# EAGLE design DC-DC_prom_v2 (EAGLE 6.1)
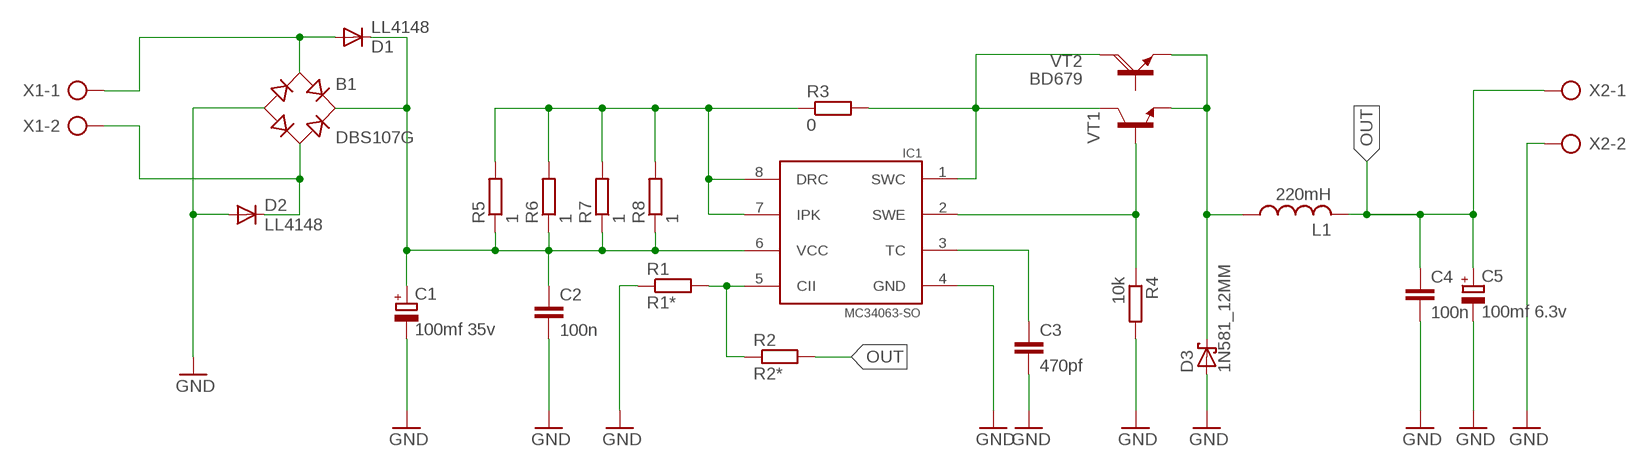
[diagram p0: schematic, sheet 1]

## Parts
B1  DBS107G  [DBS]
C1  100mf 35v  CPOL-EUE2.5-7  [E2,5-7]
C2  100n  C-EUC0805  [C0805]
C3  470pf  C-EUC0805  [C0805]
C4  100n  C-EUC0805  [C0805]
C5  100mf 6.3v  CPOL-EUE2.5-7  [E2,5-7]
D1  LL4148  [SOD80_DO213AA_MINIMELF]
D2  LL4148  [SOD80_DO213AA_MINIMELF]
D3  1N581_12MM  [DO41-12]
IC1  MC34063-SO  [SO8]
L1  220mH  L-US6000-XXX-RC  [6000-XXXX-RC]
R1  R1*  R-EU_M0805  [M0805]
R2  R2*  R-EU_M0805  [M0805]
R3  0  R-EU_M1406  [M1406]
R4  10k  R-EU_M0805  [M0805]
R5  1  R-EU_M1206  [M1206]
R6  1  R-EU_M1206  [M1206]
R7  1  R-EU_M1206  [M1206]
R8  1  R-EU_M1206  [M1206]
VT1  BCX56-16  [SOT89]
VT2  BD679  [TO126AV]
X1  AK500/2  [AK500/2]
X2  AK500/2  [AK500/2]

## Nets
GND: B1.- C1.- C2.2 C3.2 C4.2 C5.- D2.A D3.A IC1.4(GND) R1.1 R4.2 X2.2
N$1: D3.C L1.1 VT1.E VT2.E
N$2: IC1.5(CII) R1.2 R2.1
N$7: IC1.1(SWC) R3.2 VT1.C VT2.C
N$10: IC1.7(IPK) IC1.8(DRC) R3.1 R5.2 R6.2 R7.2 R8.2
N$15: B1.AC1 D1.A X1.1
N$16: B1.AC2 D2.C X1.2
N$29: B1.+ C1.+ C2.1 D1.C IC1.6(VCC) R5.1 R6.1 R7.1 R8.1
N$129: C3.1 IC1.3(TC)
N$151: IC1.2(SWE) R4.1 VT1.B
OUT: C4.1 C5.+ L1.2 R2.2 X2.1
Unconnected: VT2.B

## Library data of the parts
B1 = rectifier:DB?*G: Single Phase 1.0 AMP Glass Passivated Bridge Rectifier Taiwan Semiconductor Co.,Ltd. - TSC Source: http://www.taiwansemi.com/TSCbig5/ezcatfiles/cust/img/img/db101g.pdf http://www.ts.com.tw/db/pictures/modules/PDT/PDT060207001/DBLS201G.pdf
C1 C5 = rcl:CPOL-EU: POLARIZED CAPACITOR, European symbol
C2-C4 = rcl:C-EU: CAPACITOR, European symbol
D1 D2 = diodes_smd:LL4148: 1N4148 General Purpose Rectifie SMD-Version of 1N4148 Case: SOD 80 = DO 213 AA = MINIMELF (Glass) Author: Dipl.-Ing. FH Rainer Bayer HHN Hochschule Heilbronn, rainer.bayer@hs-heilbronn.de Ingenieurbüro ing-rb, mail@ing-rb.de
D3 = diode:1N581*: 1.0A SCHOTTKY BARRIER RECTIFIER Source: http://www.diodes.com/datasheets/ds23001.pdf
IC1 = mc34063:MC34063-SO: DC/DC converter MC34063 in SO08.
L1 = rcl:L-US: INDUCTOR, American symbol
R1-R8 = rcl:R-EU_: RESISTOR, European symbol
VT1 = mylib:BCX56-16
VT2 = transistor-power:BD679: NPN DARLINGTON TRANSISTOR
X1 X2 = con-ptr500:AK500/2: CONNECTOR; OC_FARNELL: unknown; OC_NEWARK: unknown

## Board
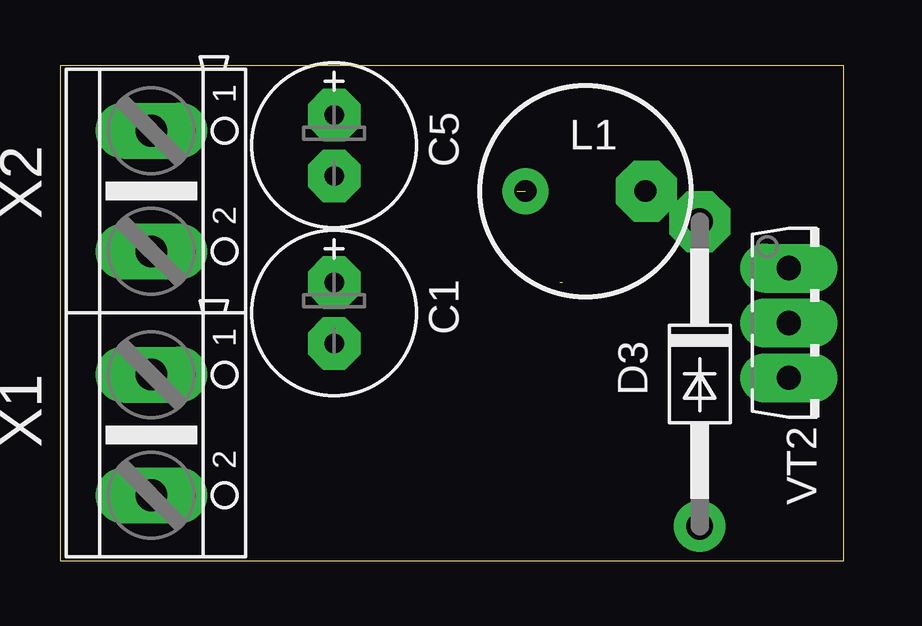
[diagram p1: board, top side]
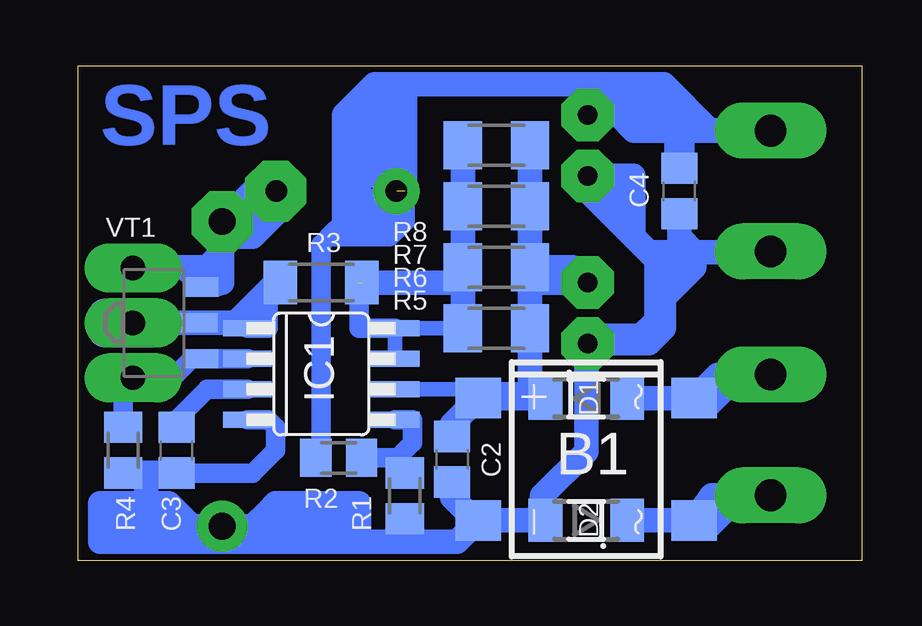
[diagram p2: board, bottom side, seen from below]

Size 32.68 x 20.63 mm. Coordinates in mm from the lower left corner, seen from the top.
Outline: 0,0 32.68,0 32.68,20.62 0,20.62 0,0
Copper layers (1*16): Top 0.035mm / dielectric 1.5mm / Bottom 0.035mm
Design rules: minimum track width 13mil, minimum drill 24mil, track to track 13mil, track to pad 8mil, pad to pad 8mil, via to via 8mil, smd to smd 8mil, copper to edge 40mil, drill to drill 8mil, minimum pad ring 20mil, minimum via ring 8mil, stop-mask expansion 4mil, vias tented up to drill 0mil, thermal gap 10mil

### Footprints (pad centres in the part's own frame; a part is rotated, then mirrored left to right if it is on the bottom)
DBS = smd 1.7 x 1.9: + -2.55,-4.5; - 2.55,-4.5; AC1 -2.55,4.5; AC2 2.55,4.5
E2,5-7 = drill 0.813 pad 1.6: + -1.27,0 | drill 0.813 pad 1.6 octagon: - 1.27,0
C0805 = smd 1.3 x 1.5: 1 -0.95,0; 2 0.95,0
SOD80_DO213AA_MINIMELF = smd 1.4 x 1.8: A 1.7,0; C -1.7,0
DO41-12 = drill 1.118: A 3.81,0; C -8.89,0
SO8 = smd 0.66 x 2.032: 1 -1.905,-3.073; 2 -0.635,-3.073; 3 0.635,-3.073; 4 1.905,-3.073; 5 1.905,3.073; 6 0.635,3.073; 7 -0.635,3.073; 8 -1.905,3.073
6000-XXXX-RC = drill 0.9 pad 1.422: 1 -2.5,0; 2 2.5,0
M0805 = smd 1.3 x 1.6: 1 -0.95,0; 2 0.95,0
M1406 = smd 1.4 x 1.8: 1 -1.7,0; 2 1.7,0
M1206 = smd 1.6 x 2: 1 -1.4,0; 2 1.4,0
SOT89 = smd 0.8 x 1.4: B -1.499,-1.981; E 1.499,-1.981 | smd 0.8 x 1.9: C 0,-1.727 | smd 2.032 x 3.65: C@1 0,0.94
TO126AV = drill 1.016 long: B 2.286,-1.27; C 0,-1.27; E -2.286,-1.27
AK500/2 = drill 1.321 long: 1 -2.515,0; 2 2.515,0

### Placement (x,y rotation side)
B1  11.49,4.22 270 bottom
C1  11.43,10.32 270 top
C2  17.08,4.22 270 bottom
C3  28.57,4.6 270 bottom
C4  7.62,15.4 270 bottom
C5  11.43,17.3 270 top
D1  11.49,6.76 0 bottom
D2  11.49,1.68 180 bottom
D3  26.67,5.24 270 top
IC1  22.54,7.78 270 bottom
L1  21.91,15.4 180 top
R1  19.05,2.7 90 bottom
R2  21.81,4.29 180 bottom
R3  22.54,11.59 180 bottom
R4  30.8,4.6 270 bottom
R5  15.24,9.68 180 bottom
R6  15.24,17.3 180 bottom
R7  15.24,14.76 180 bottom
R8  15.24,12.22 180 bottom
VT1  29.53,9.91 90 bottom
VT2  31.65,9.91 270 top
X1  3.81,5.24 270 top
X2  3.81,15.4 270 top

### Tracks (layer width: path | path; a pad name or v marks a point on that pad's centre or on a via)
GND
  Bottom 0.61: 30.79,3.97 R4.2
  Bottom 0.813: R1.1 19.05,0.79 | B1.- 15.99,1.55 15.88,1.43 | IC1.4 24.77,5.87 24.45,5.56 24.45,4.6 25.4,3.65 C3.2 | 20.32,0.79 23.5,0.79
  Bottom 1.016: C1.- 11.49,8.41 | 11.49,8.41 11.49,4.54 13.34,2.7 13.34,2.06 | 13.34,2.06 13.34,1.82 | 13.34,1.82 D2.A | 13.34,2.06 13.73,1.67 B1.- 16.87,0.79 19.05,0.79 20.32,0.79 20.96,0.79 | 13.34,1.82 13.34,1.43 | 9.53,13.49 11.43,15.4 C5.- 9.53,16.03 9.53,14.13 | 9.53,13.49 8.89,12.86 | 8.89,12.86 8.26,12.22 | 8.26,12.22 8.26,10.95 | 8.26,10.95 8.26,9.68 8.89,9.05 10.8,9.05 | C2.2 17.08,2.63 15.88,1.43 | C4.2 7.62,13.49 | 3.84,12.86 3.81,12.86 | D3.A 26.04,0.79 24.77,0.79 25.4,1.43 | D3.A 27.94,1.43 | C3.2 29.85,3.65 | 8.26,12.22 6.98,12.22 | 6.98,12.22 6.98,12.86 | 6.98,12.86 3.84,12.86 | 3.84,12.86 X2.2 | 7.62,13.49 7.62,12.86 8.57,12.86 | 8.89,12.86 8.57,12.86 | 8.57,12.86 6.98,12.86 | 6.98,12.86 7.62,13.49 | 6.98,12.22 8.26,10.95 | D3.A 27.31,0.79 | 29.85,2.38 28.89,2.38 27.94,1.43 | 27.94,1.43 30.48,2.06 31.75,1.43 29.21,1.43 | 20.96,0.79 20.96,2.38 24.45,2.38 24.77,2.06 | 20.96,0.79 23.5,0.79 31.75,0.79 31.75,2.38 29.85,2.38 | 25.4,1.43 24.77,2.06 | 24.77,2.06 21.59,2.06 21.59,1.43 24.77,1.43 | D3.A 25.4,1.43 | 29.85,3.65 R4.2 | 29.85,2.38 29.85,3.65 | 9.53,13.49 9.53,14.13 | 9.53,14.13 10.8,15.4 10.16,15.4 | C1.- 10.8,9.05 | 10.8,9.05 11.49,8.41 | C1.- 11.11,9.37 9.21,9.37 8.57,10 8.57,12.86
N$1
  Bottom 0.813: 26.67,12.86 26.67,11.59 26.85,11.4 VT1.E 28.33,12.19 VT2.E
  Bottom 1.016: L1.1 D3.C | D3.C 25.4,15.4 24.13,15.4 24.13,14.76 25.4,13.49 26.04,13.49 D3.C | D3.C 25.4,14.13 | 30.48,12.22 27.31,12.22 26.67,12.86 D3.C | D3.C 26.67,11.59
N$2
  Bottom 0.813: IC1.5 18.73,5.87 18.73,4.92 19.37,4.29 | R2.1 19.37,4.29 | 19.37,4.29 19.37,3.97 R1.2
N$5  (via drill 0.8 pad 2.54)
  other vias: 24.45,15.4
N$6  (via drill 1 pad 2.54)
  other vias: 26.67,14.13
N$7
  Bottom 0.813: VT1.C 25.96,9.91 IC1.1 24.77,9.68 24.77,10.95 R3.2 24.13,11.59
  Bottom 1.016: 24.13,11.59 24.77,10.95 25.81,9.91 VT1.C VT2.C | R3.2 24.45,11.59 26.04,10
N$8
  Bottom 1.016: 6.98,1.43 6.35,1.43 5.08,2.7
N$9
  Bottom 1.016: 6.98,6.51 6.35,6.51 5.08,7.78
N$10  (1 unrouted)
  Bottom 0.61: IC1.7 IC1.8 R5.2
  Bottom 0.813: IC1.8 20.96,9.68 20.96,11.59
  Bottom 1.016: R6.2 R7.2 R8.2 R5.2 | 20.96,11.59 16.51,11.59
N$11  (via drill 0.8 pad 2.18)
  other vias: 11.43,16.03
N$12  (via drill 0.8 pad 2.18)
  other vias: 11.43,11.59
N$14  (via drill 0.8 pad 2.18)
  other vias: 11.43,9.05
N$15
  Bottom 1.016: X1.1 6.01,7.75 B1.AC1 9.53,6.77 9.53,6.76 | D1.A 9.53,6.76 | 9.53,6.76 9.53,6.51
N$16
  Bottom 1.016: X1.2 6.26,2.72 B1.AC2 7.64,1.68 D2.C
N$17  (via drill 0.8 pad 2.18)
  other vias: 11.43,18.57
N$29
  Bottom 0.61: 13.84,7.02 B1.+ | B1.+ 15.61,6.77 | IC1.6 13.97,7.14 13.97,6.89 B1.+
  Bottom 1.016: R6.1 R7.1 R8.1 | R8.1 R5.1 13.84,7.02 | D1.C 14.09,6.76 B1.+ 17.08,5.68 C2.1 | R8.1 12.07,12.22 C1.+ 13.97,11.59
N$129
  Bottom 0.61: C3.1 28.57,5.87
  Bottom 0.813: IC1.3 27.31,7.14 28.57,5.87
N$151
  Bottom 0.813: R4.1 30.8,6.83 29.85,7.78 28.57,7.78 27.94,8.41 27.87,8.41 | 27.87,8.41 27.64,8.41 | 27.64,8.41 VT1.B 27.87,8.41 | IC1.2 27.64,8.41
OUT  (1 unrouted)
  Bottom 0.813: R2.2 22.54,3.97 22.54,13.18 22.23,13.49 | 22.23,13.49 20.32,13.49 | 20.32,13.49 19.68,13.49 19.05,14.13 19.05,15.4 20.32,14.13 21.59,14.13 | 20.32,13.49 19.68,14.13 19.05,16.03 | 21.59,14.13 22.23,13.49 | 21.59,14.13 19.05,16.03 | 19.05,16.03 20.32,14.76
  Bottom 1.016: X2.1 7.62,17.91 9.5,17.91 10.16,18.57 C5.+ 11.43,19.84 | 11.43,19.84 19.05,19.84 | 19.05,19.84 19.05,16.03 19.05,15.4 | 3.81,17.94 6.35,17.94 8.26,19.84 11.43,19.84 | 11.43,19.84 10.8,19.21 10.16,19.21 9.53,18.57 8.26,18.57 | 7.62,18.57 8.26,18.57 | 8.26,18.57 8.89,19.21 9.53,19.21 | 19.05,19.84 20.32,19.84 21.59,18.57 21.59,14.76 | 21.59,14.13 21.59,14.76 | 21.59,14.76 20.96,15.4 20.96,17.94 19.68,19.21 19.68,16.67 20.32,16.03 20.32,17.94
  Bottom 1.27: C4.1 7.62,17.91

### Text on the board
Bottom: SPS
Document: SPS | 2013 | OUT | IN